# Altium schematic sheet VoltageRegulators.SchDoc
size A
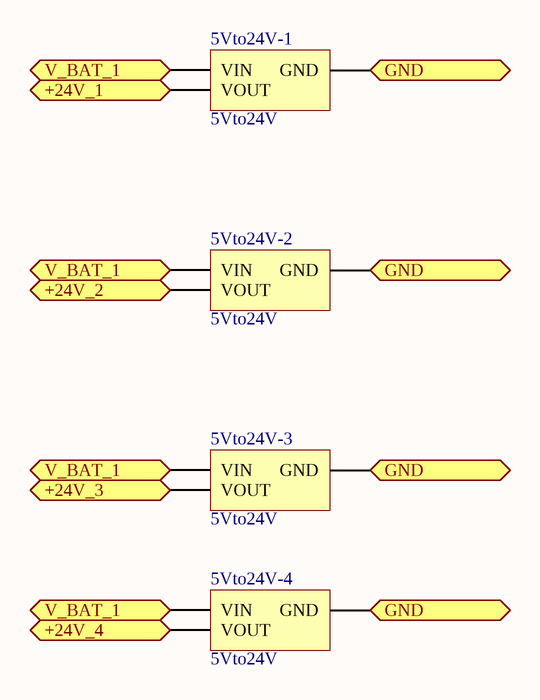
[diagram p0: VoltageRegulators.SchDoc]

## Parts
5Vto24V-1  5Vto24V  [5Vto24V]
5Vto24V-2  5Vto24V  [5Vto24V]
5Vto24V-3  5Vto24V  [5Vto24V]
5Vto24V-4  5Vto24V  [5Vto24V]

## Ports
+24V_1 (bidir), +24V_2 (bidir), +24V_3 (bidir), +24V_4 (bidir), GND (bidir), V_BAT_1 (bidir)

## Nets
+24V_1: 5Vto24V-1.3(VOUT) ; port +24V_1
+24V_2: 5Vto24V-2.3(VOUT) ; port +24V_2
+24V_3: 5Vto24V-3.3(VOUT) ; port +24V_3
+24V_4: 5Vto24V-4.3(VOUT) ; port +24V_4
GND: 5Vto24V-1.2(GND) 5Vto24V-2.2(GND) 5Vto24V-3.2(GND) 5Vto24V-4.2(GND) ; port GND
V_BAT_1: 5Vto24V-1.P1-1(VIN) 5Vto24V-2.P1-1(VIN) 5Vto24V-3.P1-1(VIN) 5Vto24V-4.P1-1(VIN) ; port V_BAT_1